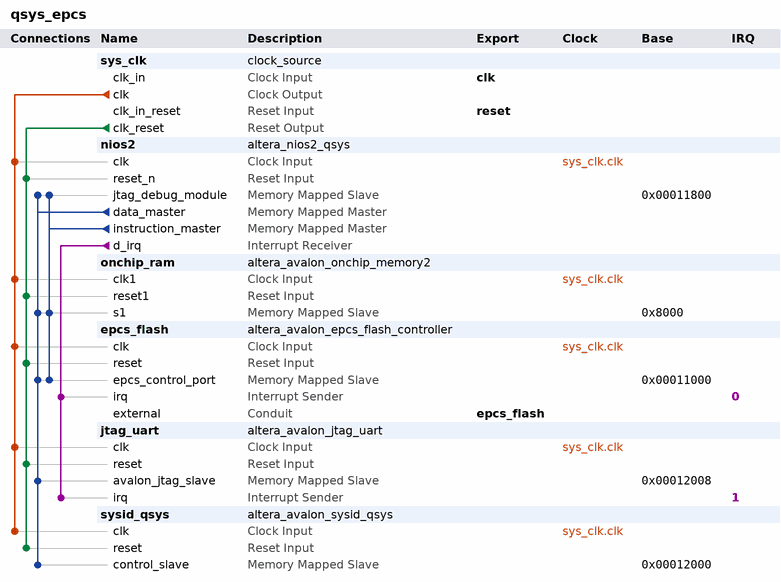
[diagram p0: system contents]
# Platform Designer (Qsys) system qsys_epcs, Cyclone IV E EP4CE10F17C8
# Parameters at their usual value, and those the tool derives, are not listed.
package require -exact qsys 13.1
create_system qsys_epcs
set_project_property DEVICE_FAMILY {Cyclone IV E}
set_project_property DEVICE EP4CE10F17C8

add_instance sys_clk clock_source 13.1
set_instance_parameter_value sys_clk clockFrequency 50000000

add_instance nios2 altera_nios2_qsys 13.1
set_instance_parameter_value nios2 resetSlave epcs_flash.epcs_control_port
set_instance_parameter_value nios2 mmu_TLBMissExcSlave None
set_instance_parameter_value nios2 exceptionSlave onchip_ram.s1
set_instance_parameter_value nios2 breakSlave nios2.jtag_debug_module
set_instance_parameter_value nios2 impl Fast
set_instance_parameter_value nios2 icache_size 4096

add_instance onchip_ram altera_avalon_onchip_memory2 13.1
set_instance_parameter_value onchip_ram dataWidth 32
set_instance_parameter_value onchip_ram dualPort false
set_instance_parameter_value onchip_ram initMemContent true
set_instance_parameter_value onchip_ram initializationFileName onchip_mem.hex
set_instance_parameter_value onchip_ram memorySize 30720

add_instance epcs_flash altera_avalon_epcs_flash_controller 13.1

add_instance jtag_uart altera_avalon_jtag_uart 13.1
set_instance_parameter_value jtag_uart simInteractiveOptions NO_INTERACTIVE_WINDOWS

add_instance sysid_qsys altera_avalon_sysid_qsys 13.1
set_instance_parameter_value sysid_qsys id 0

# connections
add_connection sys_clk.clk epcs_flash.clk clock
add_connection sys_clk.clk jtag_uart.clk clock
add_connection sys_clk.clk nios2.clk clock
add_connection sys_clk.clk onchip_ram.clk1 clock
add_connection sys_clk.clk sysid_qsys.clk clock
add_connection sys_clk.clk_reset epcs_flash.reset reset
add_connection sys_clk.clk_reset jtag_uart.reset reset
add_connection sys_clk.clk_reset nios2.reset_n reset
add_connection sys_clk.clk_reset onchip_ram.reset1 reset
add_connection sys_clk.clk_reset sysid_qsys.reset reset
add_connection nios2.data_master epcs_flash.epcs_control_port avalon
set_connection_parameter_value nios2.data_master/epcs_flash.epcs_control_port baseAddress 0x00011000
add_connection nios2.data_master jtag_uart.avalon_jtag_slave avalon
set_connection_parameter_value nios2.data_master/jtag_uart.avalon_jtag_slave baseAddress 0x00012008
add_connection nios2.data_master nios2.jtag_debug_module avalon
set_connection_parameter_value nios2.data_master/nios2.jtag_debug_module baseAddress 0x00011800
add_connection nios2.data_master onchip_ram.s1 avalon
set_connection_parameter_value nios2.data_master/onchip_ram.s1 baseAddress 0x8000
add_connection nios2.data_master sysid_qsys.control_slave avalon
set_connection_parameter_value nios2.data_master/sysid_qsys.control_slave baseAddress 0x00012000
add_connection nios2.instruction_master epcs_flash.epcs_control_port avalon
set_connection_parameter_value nios2.instruction_master/epcs_flash.epcs_control_port baseAddress 0x00011000
add_connection nios2.instruction_master nios2.jtag_debug_module avalon
set_connection_parameter_value nios2.instruction_master/nios2.jtag_debug_module baseAddress 0x00011800
add_connection nios2.instruction_master onchip_ram.s1 avalon
set_connection_parameter_value nios2.instruction_master/onchip_ram.s1 baseAddress 0x8000
add_connection nios2.d_irq epcs_flash.irq interrupt
set_connection_parameter_value nios2.d_irq/epcs_flash.irq irqNumber 0
add_connection nios2.d_irq jtag_uart.irq interrupt
set_connection_parameter_value nios2.d_irq/jtag_uart.irq irqNumber 1

# exported interfaces
add_interface clk clock sink
set_interface_property clk EXPORT_OF sys_clk.clk_in
add_interface reset reset sink
set_interface_property reset EXPORT_OF sys_clk.clk_in_reset
add_interface epcs_flash conduit end
set_interface_property epcs_flash EXPORT_OF epcs_flash.external

set_interconnect_requirement {$system} qsys_mm.clockCrossingAdapter HANDSHAKE
set_interconnect_requirement {$system} qsys_mm.maxAdditionalLatency 1
set_interconnect_requirement {$system} qsys_mm.insertDefaultSlave false

save_system qsys_epcs.qsys
